# EAGLE schematic 2x_relay (EAGLE 8.3.0)
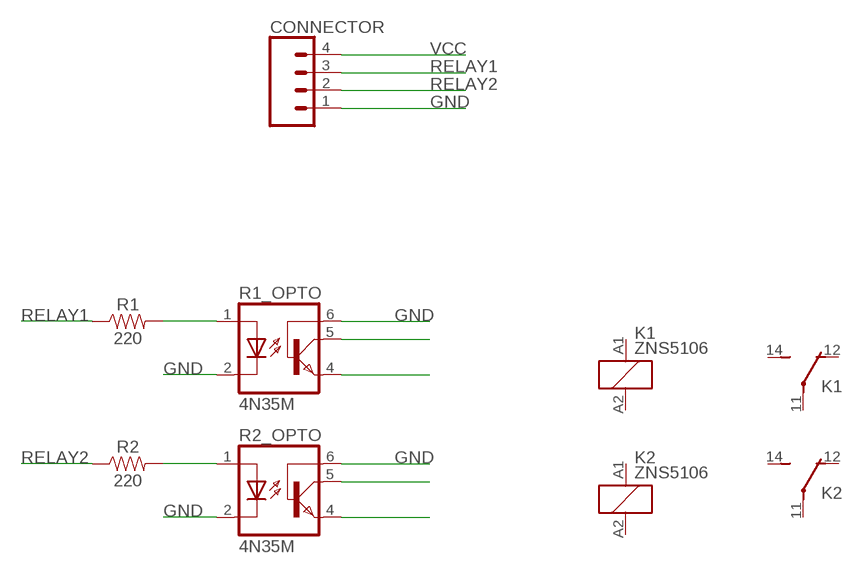
[diagram p0: schematic, sheet 1]

## Parts
CONNECTOR  CONN_04POLAR  [MOLEX-1X4]
K1  ZNS5106  [ZN5]
K2  ZNS5106  [ZN5]
R1  220  1KOHM-HORIZ-1/4W-1%  [AXIAL-0.3]
R1_OPTO  4N35M  [DIL06]
R2  220  1KOHM-HORIZ-1/4W-1%  [AXIAL-0.3]
R2_OPTO  4N35M  [DIL06]

## Nets
GND: CONNECTOR.1 R1_OPTO.2(C) R1_OPTO.6(BAS) R2_OPTO.2(C) R2_OPTO.6(BAS)
N$1: R1.P$2 R1_OPTO.1(A)
N$2: R2.P$2 R2_OPTO.1(A)
N$5: R1_OPTO.5(COL)
N$6: R1_OPTO.4(EMI)
N$8: R2_OPTO.5(COL)
N$9: R2_OPTO.4(EMI)
RELAY1: CONNECTOR.3 R1.P$1
RELAY2: CONNECTOR.2 R2.P$1
VCC: CONNECTOR.4
Unconnected: K1.11(2:P) K1.12(2:O) K1.14(2:S) K1.A1 K1.A2 K2.11(2:P) K2.12(2:O) K2.14(2:S) K2.A1 K2.A2

## Library data of the parts
CONNECTOR = SparkFun-Connectors:CONN_04: Multi connection point. Often used as Generic Header-pin footprint for 0.1 inch spaced/style header connections On any of the 0.1 inch spaced packages, you can populate with these: Break Away Headers - Straight <https://www.sparkfun.com/products/116> (PRT-00116) Break Away Male Headers - Right Angle <https://www.sparkfun.com/products/553> (PRT-00553) Female Headers <https://www.sparkfun.com/products/115> (PRT-00115) Break Away Headers - Machine Pin <https://www.sparkfun.com/products/117> (PRT-00117) Break Away Female Headers - Swiss Machine Pin <https://www.sparkfun.com/products/743> (PRT-00743) For SCREWTERMINALS and SPRING TERMINALS visit here: Screw Terimnals on SparkFun.com <https://www.sparkfun.com/search/results?term=Screw+Terminals> (5mm/3.5mm/2.54mm spacing) This device is also useful as a general connection point to wire up your design to another part of your project. Our various solder wires solder well into these plated through hole pads. Hook-Up Wire - Assortment (Stranded, 22 AWG) <https://www.sparkfun.com/products/11375> (PRT-11375) Hook-Up Wire - Assortment (Solid Core, 22 AWG) <https://www.sparkfun.com/products/11367> (PRT-11367) View the entire wire category on our website here <https://www.sparkfun.com/categories/141> Special notes: Molex polarized connector foot print use with SKU : PRT-08231 with associated crimp pins and housings. 1MM SMD Version SKU: PRT-10208; PROD_ID: CONN-08186; SF_ID: PRT-08231
K1 K2 = relay:ZNS5*: Miniature Power PCB Relay SCHRACK 1pole 10 A Source: http://www.schrack.com/.. 5847.pdf; OC_FARNELL: unknown; OC_NEWARK: unknown
R1 R2 = SparkFun-Resistors:1KOHM: 1kΩ resistor A resistor is a passive two-terminal electrical component that implements electrical resistance as a circuit element. Resistors act to reduce current flow, and, at the same time, act to lower voltage levels within circuits. - Wikipedia; PROD_ID: RES-12182; VALUE: 1k
R1_OPTO R2_OPTO = optocoupler:4N*?M: General Purpose 6-Pin Phototransistor Optocouplers Source: http://www.fairchildsemi.com/ds/4N/4N35-M.pdf; MPN: 4N35-M; OC_FARNELL: 1021351; OC_NEWARK: 98K9114